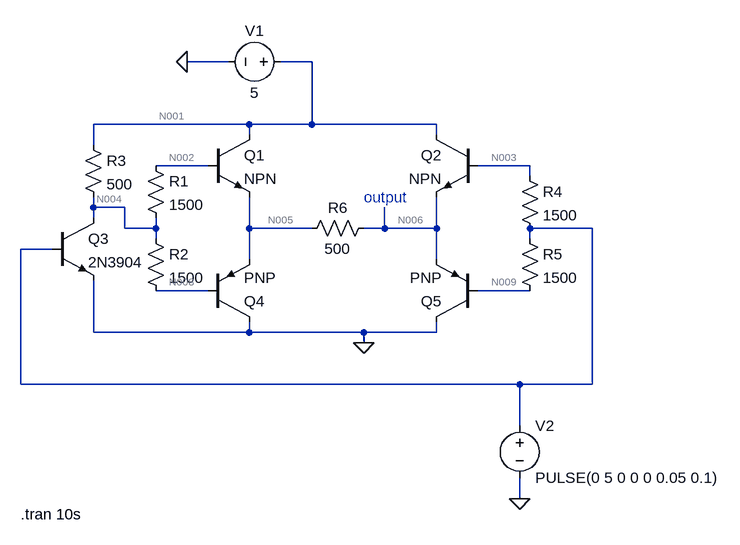
[diagram p0: schematic dog_repellent_circuit (2).asc]
dog_repellent_circuit (2).asc, the LTspice schematic file:
Version 4
SHEET 1 880 680
WIRE 64 -48 0 -48
WIRE 192 -48 144 -48
WIRE 96 48 -144 48
WIRE 192 48 192 -48
WIRE 192 48 96 48
WIRE 384 48 192 48
WIRE 96 64 96 48
WIRE 384 64 384 48
WIRE -144 80 -144 48
WIRE 32 112 -48 112
WIRE 528 112 448 112
WIRE 528 128 528 112
WIRE -144 176 -144 160
WIRE -96 176 -144 176
WIRE -144 192 -144 176
WIRE -96 208 -96 176
WIRE -48 208 -48 192
WIRE -48 208 -96 208
WIRE 96 208 96 160
WIRE 192 208 96 208
WIRE 304 208 304 176
WIRE 304 208 272 208
WIRE 384 208 384 160
WIRE 384 208 304 208
WIRE 624 208 528 208
WIRE -48 224 -48 208
WIRE 528 224 528 208
WIRE -208 240 -256 240
WIRE 96 256 96 208
WIRE 384 256 384 208
WIRE 32 304 -48 304
WIRE 528 304 448 304
WIRE -144 368 -144 288
WIRE 96 368 96 352
WIRE 96 368 -144 368
WIRE 272 368 96 368
WIRE 384 368 384 352
WIRE 384 368 272 368
WIRE 272 384 272 368
WIRE -256 448 -256 240
WIRE 512 448 -256 448
WIRE 624 448 624 208
WIRE 624 448 512 448
WIRE 512 512 512 448
WIRE 512 624 512 592
FLAG 0 -48 0
FLAG 272 384 0
FLAG 512 624 0
SYMBOL npn -208 192 R0
SYMATTR InstName Q3
SYMATTR Value 2N3904
SYMBOL res -64 96 R0
SYMATTR InstName R1
SYMATTR Value 1500
SYMBOL res -64 208 R0
SYMATTR InstName R2
SYMATTR Value 1500
SYMBOL res -160 64 R0
SYMATTR InstName R3
SYMATTR Value 500
SYMBOL voltage 160 -48 R90
WINDOW 0 -32 56 VBottom 2
WINDOW 3 32 56 VTop 2
WINDOW 123 0 0 Left 0
WINDOW 39 0 0 Left 0
SYMATTR InstName V1
SYMATTR Value 5
SYMBOL res 512 112 R0
SYMATTR InstName R4
SYMATTR Value 1500
SYMBOL res 512 208 R0
SYMATTR InstName R5
SYMATTR Value 1500
SYMBOL voltage 512 496 R0
WINDOW 123 0 0 Left 0
WINDOW 39 0 0 Left 0
SYMATTR InstName V2
SYMATTR Value PULSE(0 5 0 0 0 0.05 0.1)
SYMBOL npn 32 64 R0
SYMATTR InstName Q1
SYMBOL npn 448 64 M0
SYMATTR InstName Q2
SYMBOL pnp 32 352 M180
SYMATTR InstName Q4
SYMBOL pnp 448 352 R180
SYMATTR InstName Q5
SYMBOL res 288 192 R90
WINDOW 0 0 56 VBottom 2
WINDOW 3 32 56 VTop 2
SYMATTR InstName R6
SYMATTR Value 500
TEXT -256 648 Left 2 !.tran 10s
TEXT 272 160 Left 2 ;output

The netlist it stands for:
* dog_repellent_circuit (2).asc
Q3 N004 N007 0 0 2N3904
R1 N002 N004 1500
R2 N004 N008 1500
R3 N001 N004 500
V1 N001 0 5
R4 N003 N007 1500
R5 N007 N009 1500
V2 N007 0 PULSE(0 5 0 0 0 0.05 0.1)
Q1 N001 N002 N005 0 NPN
Q2 N001 N003 N006 0 NPN
Q4 0 N008 N005 0 PNP
Q5 0 N009 N006 0 PNP
R6 N006 N005 500
.model NPN NPN
.model PNP PNP
.lib standard.bjt
.tran 10s
* output
.backanno
.end

* Results of the author's LTspice run, read from the files saved beside the schematic
* Operating Point, zero values left out:
*   V(n004) = 4.969 V
*   V(n002) = 4.876 V
*   V(n008) = 4.969 V
*   V(n001) = 5 V
*   V(n003) = 8.872 nV
*   V(n009) = 93.25 mV
*   V(n005) = 4.054 V
*   V(n006) = 914.7 mV
*   Ic(Q5) = -6.217 mA
*   Ib(Q5) = -62.17 µA
*   Ie(Q5) = 6.279 mA
*   Ic(Q4) = -4.969 pA
*   Ib(Q4) = 5.884 pA
*   Ic(Q2) = 5 pA
*   Ib(Q2) = -5.915 pA
*   Ic(Q1) = 6.217 mA
*   Ib(Q1) = 62.17 µA
*   Ie(Q1) = -6.279 mA
*   Ic(Q3) = 4.983 pA
*   Ib(Q3) = -4.971 pA
*   I(R6) = -6.279 mA
*   I(R5) = -62.17 µA
*   I(R4) = 5.915 pA
*   I(R3) = 62.17 µA
*   I(R2) = 5.884 pA
*   I(R1) = -62.17 µA
*   I(V2) = 62.17 µA
*   I(V1) = -6.279 mA
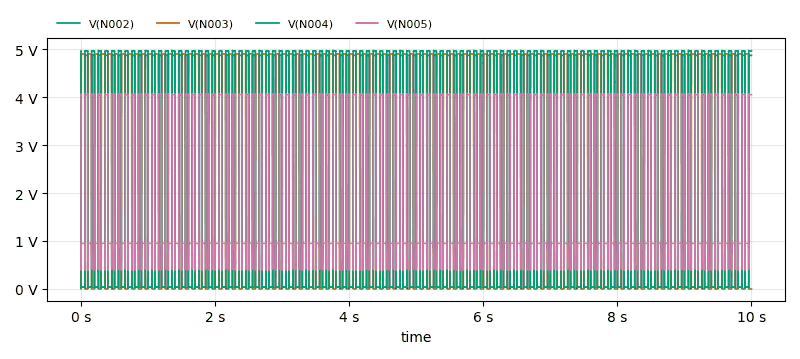
[diagram p1: Transient Analysis of dog_repellent_circuit (2).asc, plotted from the saved traces]
* Transient Analysis, 1 run:
*   V(N002): min 14.07 mV, max 4.892 V, average 2.037 V, rms 3.135 V, last 4.876 V
*   V(N003): min 0 V, max 4.907 V, average 2.7 V, rms 3.586 V, last 0 V
*   V(N004): min 14.07 mV, max 4.981 V, average 2.076 V, rms 3.195 V, last 4.969 V
*   V(N005): min 391.2 mV, max 4.074 V, average 2.221 V, rms 2.703 V, last 4.054 V